# EAGLE schematic Pocket-Boost-Converter (EAGLE 6.5.0)
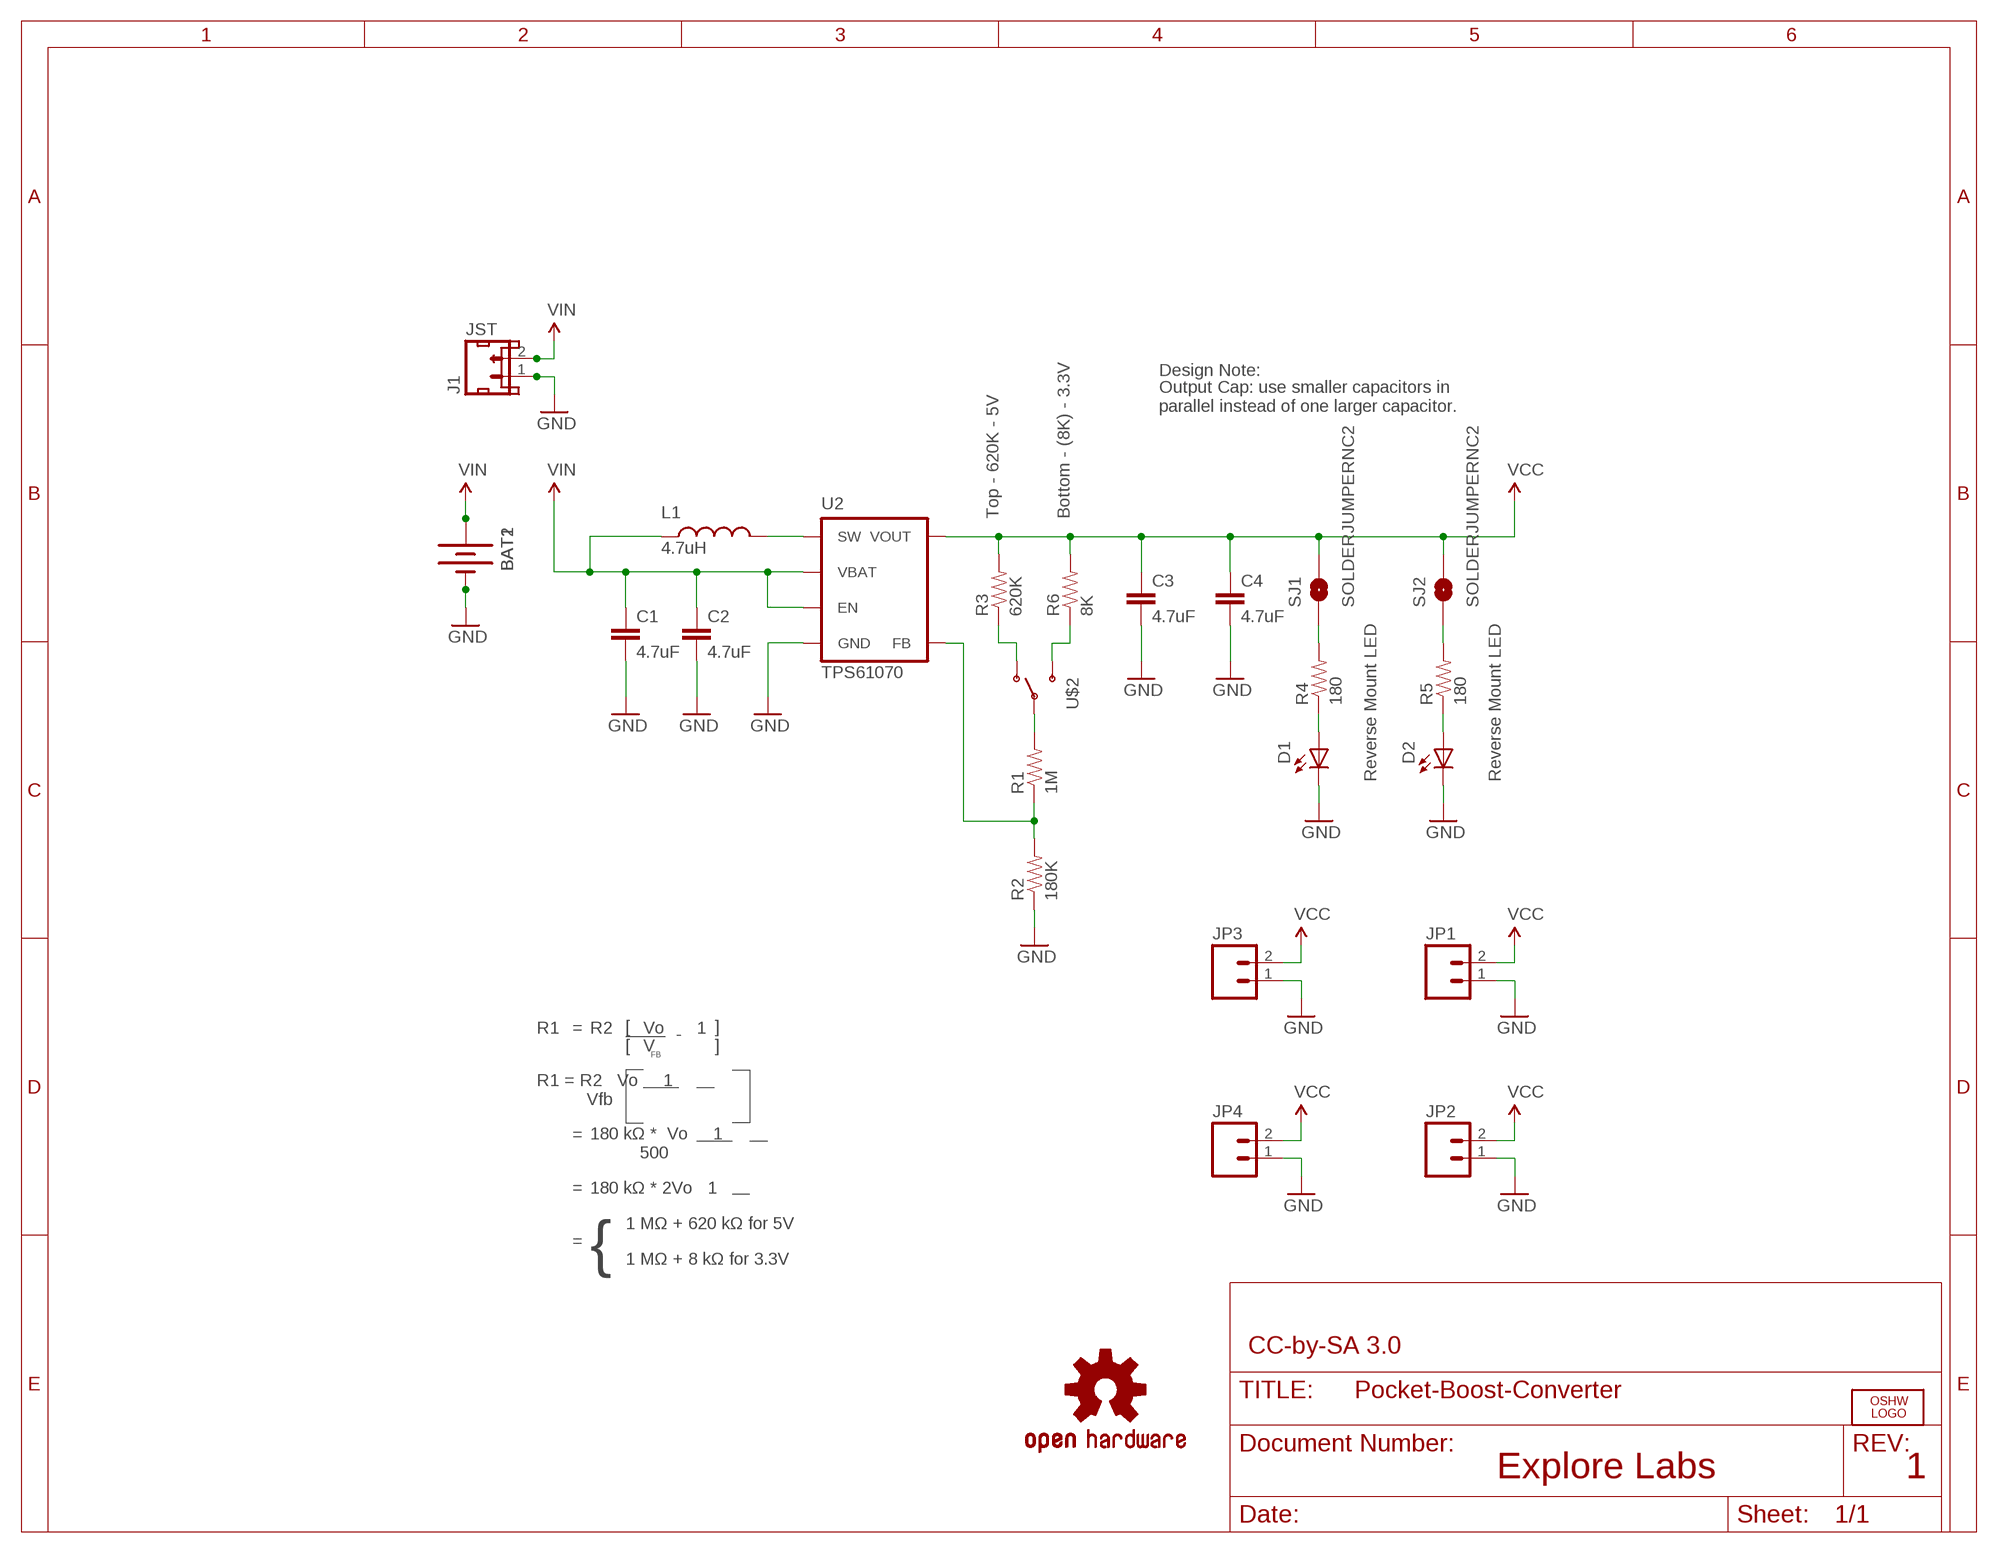
[diagram p0: schematic, sheet 1]

## Parts
BAT1  BATTERYONE-HOLE-REMOVED-FOR-REV-MNT-LED  [BATTERY-AA-HOLDER-BBPS]
BAT2  BATTERYNO-HOLES  [BATTERY-2AA-HOLDER-BBPS]
C1  4.7uF  CAP0603-CAP  [0603-CAP]
C2  4.7uF  CAP0603-CAP  [0603-CAP]
C3  4.7uF  CAP0603-CAP  [0603-CAP]
C4  4.7uF  CAP0603-CAP  [0603-CAP]
D1  Reverse Mount LED  LED-GREEN  [LED-REV-MOUNT]
D2  Reverse Mount LED  LED-GREEN  [LED-REV-MOUNT]
J1  JST_2MM_MALE  [JST-2-SMD]
JP1  M02PTH  [1X02]
JP2  M02PTH  [1X02]
JP3  M02PTH  [1X02]
JP4  M02PTH  [1X02]
JST  M02-JST-2-PTH-NO_SILK  [JST-2-PTH-NS]
L1  4.7uH  INDUCTOR  [INDUCTOR-MSS4020]
LOGO1  OSHW_LOGO_FILLX0200-NT  [OSHW_FILLX200_NOTEXT]
LOGO2  OSHW-LOGOS  [OSHW-LOGO-S]
R1  1M  RESISTOR0603-RES  [0603-RES]
R2  180K  RESISTOR0603-RES  [0603-RES]
R3  620K  RESISTOR0603-RES  [0603-RES]
R4  180  RESISTOR0603-RES  [0603-RES]
R5  180  RESISTOR0603-RES  [0603-RES]
R6  8K  RESISTOR0603-RES  [0603-RES]
SJ1  SOLDERJUMPERNC2  [SJ_2S-NOTRACE]
SJ2  SOLDERJUMPERNC2  [SJ_2S-NOTRACE]
U2  TPS61070  [DDC]
U$2  SWITCH_SPDTSMD-NO-HOLES  [SWITCH-SPST-SMD-A-FOR-BBPS]

## Nets
GND: BAT1.GND(-) BAT2.GND(-) C1.2 C2.2 C3.2 C4.2 D1.CATHODE D2.CATHODE J1.1(-) JP1.1 JP2.1 JP3.1 JP4.1 JST.1 R2.1 U2.2(GND)
N$1: R5.2 SJ2.1
N$2: R3.1 U$2.A(A-OUT)
N$3: R1.1 R2.2 U2.4(FB)
N$4: R1.2 U$2.B(BC-IN) U$2.C(BC-IN)
N$5: D2.ANODE R5.1
N$6: R6.1 U$2.D(D-OUT)
N$7: R4.2 SJ1.1
N$8: D1.ANODE R4.1
SW: L1.2 U2.1(SW)
VBAT: BAT1.PWR(+) BAT2.PWR(+) C1.1 C2.1 J1.2(+) JST.2 L1.1 U2.3(EN) U2.6(VBAT) ; supply symbol labelled VIN
VOUT: C3.1 C4.1 JP1.2 JP2.2 JP3.2 JP4.2 R3.2 R6.2 SJ1.2 SJ2.2 U2.5(VOUT) ; supply symbol labelled VCC
Unconnected: J1.NC1(PAD1) J1.NC2(PAD2)

## Notes on the sheet
- Design Note:
- Output Cap: use smaller capacitors in
  parallel instead of one larger capacitor.
- Top - 620K - 5V | Bottom - (8K) - 3.3V
- R1 | = | R2 | ____ | Vo | - | 1
- [
  [
- V | FB
- ]
  ]
- R1 = R2   Vo     1 
            Vfb
- =
- 180 kΩ *  Vo     1
            500
- = | 180 kΩ * 2Vo   1
- 1 MΩ + 620 kΩ for 5V
- =
- { | 1 MΩ + 8 kΩ for 3.3V
- CC-by-SA 3.0
- Explore Labs | 1

## Library data of the parts
BAT1 BAT2 = 11xLabs:BATTERY: Battery Holders Various common sizes : AA, AAA, 20mm coin cell and 12mm coin cell. 20MM_4LEGS, BATT-10373
C1-C4 = SparkFun-Passives:CAP: Capacitor Standard 0603 ceramic capacitor, and 0.1" leaded capacitor.
D1 D2 = 11xLabs:LED-GREEN: Various green LEDs 0603- DIO-00821 LARGE- DIO-00862 LILYPAD- DIO-09910
J1 = SparkFun-Connectors:JST_2MM_MALE: Mates to single-cell LiPo batteries. CONN-08352; PROD_ID: CONN-08352
JP1-JP4 JST = SparkFun-Connectors:M02: Header 2 Standard 2-pin 0.1" header. Use with straight break away headers (SKU : PRT-00116), right angle break away headers (PRT-00553), swiss pins (PRT-00743), machine pins (PRT-00117), and female headers (PRT-00115). Molex polarized connector foot print use with SKU : PRT-08233 with associated crimp pins and housings.
L1 = 11xLabs:INDUCTOR: Inductors Basic Inductor/Choke - 0603 and 1206. Footprints are not proven and vary greatly between part numbers.
LOGO1 = ohw-logo:OSHW_LOGO_FILL
LOGO2 = SparkFun-Aesthetics:OSHW-LOGO: Open Source Hardware Logo This logo indicates the piece of hardware it is found on incorporates a OSHW license and/or adheres to the definition of open source hardware found here: http://freedomdefined.org/OSHW
R1-R6 = SparkFun-Passives:RESISTOR: Resistor Basic schematic elements and footprints for 0603, 1206, and PTH resistors.
SJ1 SJ2 = SparkFun-Passives:SOLDERJUMPER: Solder Jumper Standard SMD solder jumper. Used to automate production. Two varients : Normally Open and Normally Closed are the same, but have different paste layers. NC will have a large amount of paste and should jumper during reflow.
U2 = 11xLabs:TPS61070
U$2 = 11xLabs:SWITCH_SPDT: Side-actuated SPDT slide switch, as used on the Arduino Pro